# EAGLE schematic PowerCell-vArsalan (EAGLE 7.6.0)
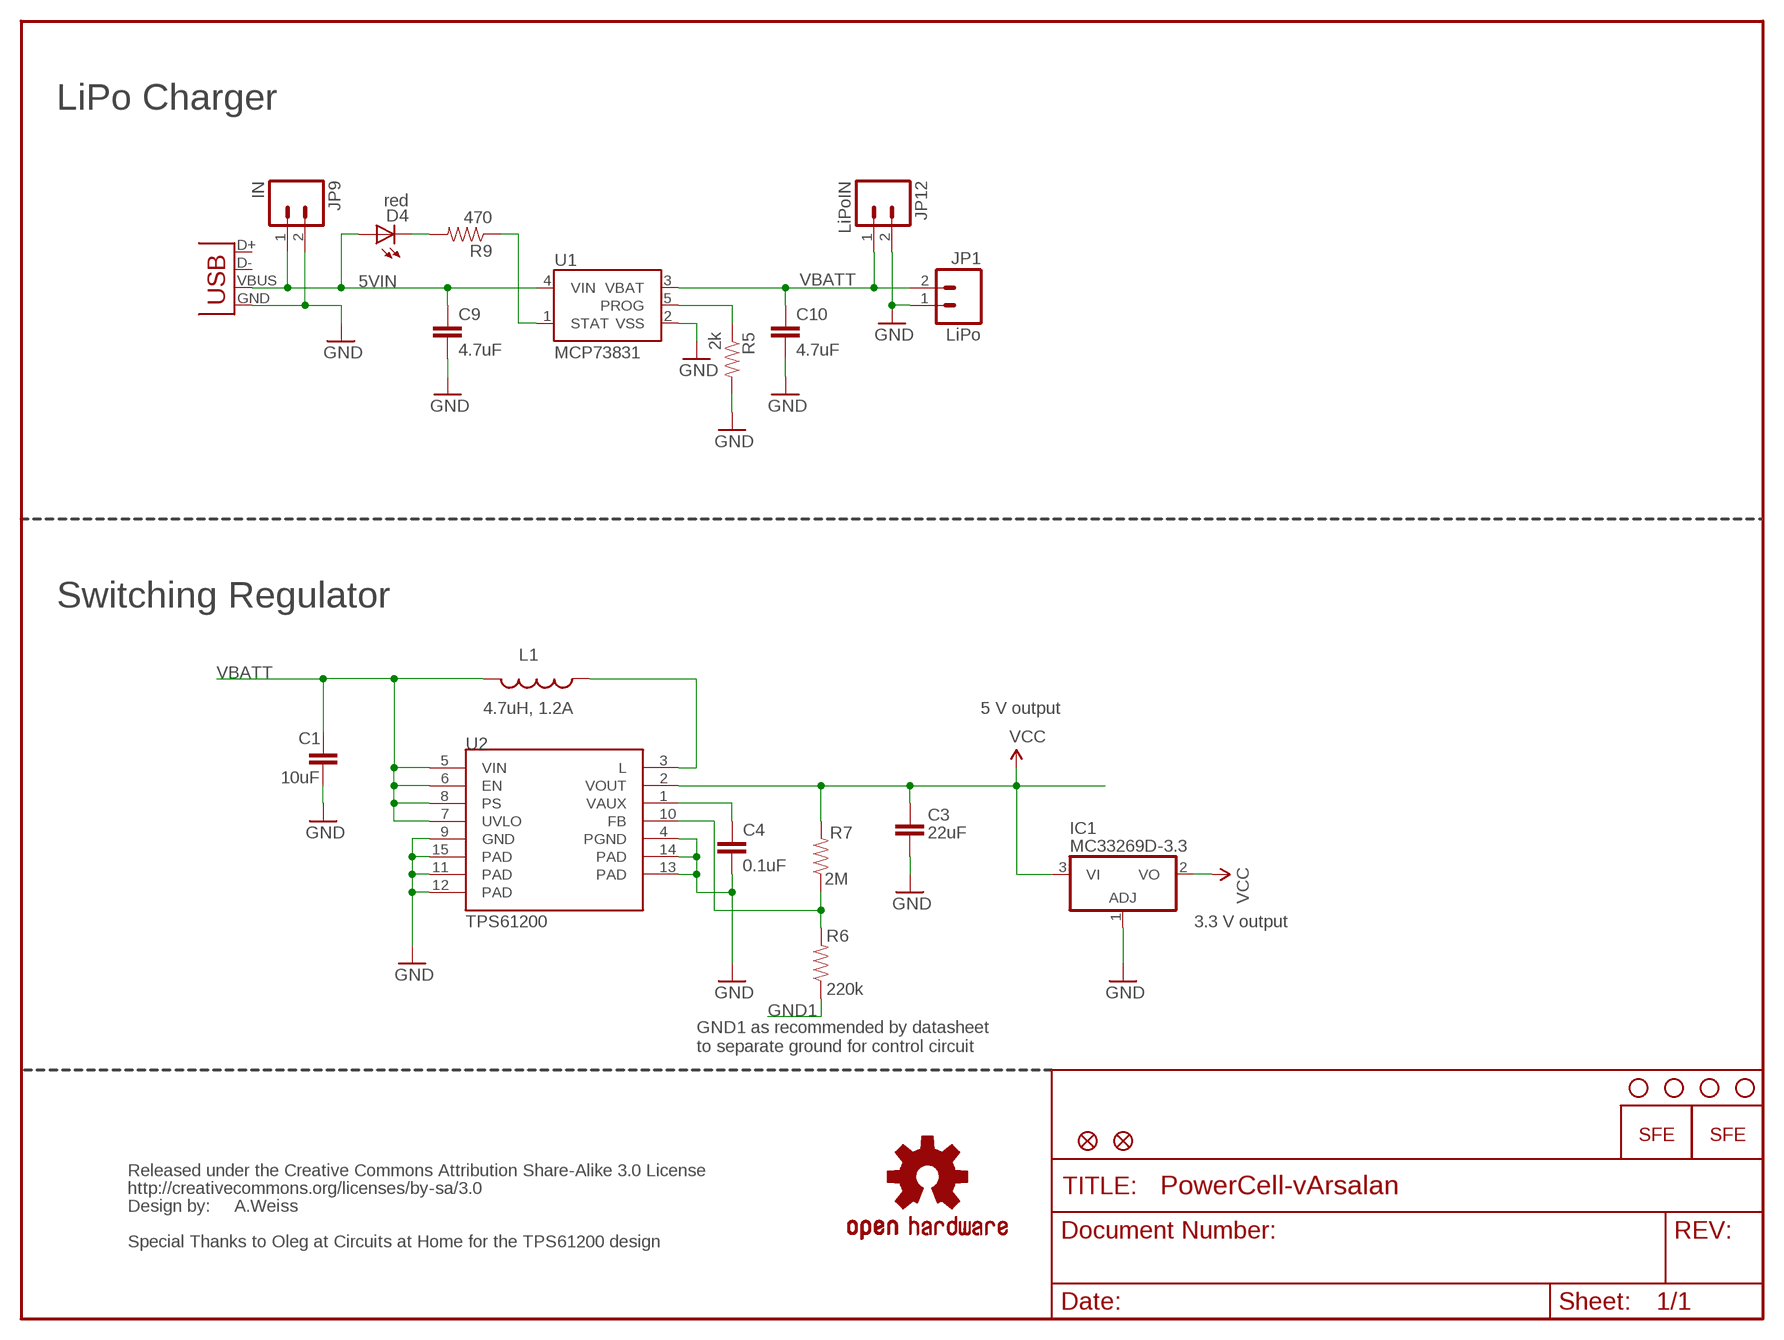
[diagram p0: schematic, sheet 1]

## Parts
C1  10uF  CAP1206  [1206]
C3  22uF  CAP0805  [0805]
C4  0.1uF  CAP0402-CAP  [0402-CAP]
C9  4.7uF  CAP0402-CAP  [0402-CAP]
C10  4.7uF  CAP0402-CAP  [0402-CAP]
D4  red  LED0603  [LED-0603]
IC1  MC33269D-3.3  [DPACK]
JP1  LiPo  M02-JST-2MM-SMT  [JST-2-SMD]
JP3  LOGO-SFENEW  [SFE-NEW-WEBLOGO]
JP4  LOGO-SFESK  [SFE-LOGO-FLAME]
JP5  STAND-OFF  [STAND-OFF]
JP6  STAND-OFF  [STAND-OFF]
JP7  STAND-OFF  [STAND-OFF]
JP8  STAND-OFF  [STAND-OFF]
JP9  IN  M02PTH  [1X02]
JP12  LiPoIN  M02PTH  [1X02]
JP15  FIDUCIALUFIDUCIAL  [MICRO-FIDUCIAL]
JP16  FIDUCIALUFIDUCIAL  [MICRO-FIDUCIAL]
L1  4.7uH, 1.2A  INDUCTOR.  [CDRH2D09]
R5  2k  RESISTOR0402-RES  [0402-RES]
R6  220k  RESISTOR0402-RES  [0402-RES]
R7  2M  RESISTOR0402-RES  [0402-RES]
R9  470  RESISTOR0402-RES  [0402-RES]
U1  MCP73831  [SOT23-5]
U2  TPS61200  [QFN-10_PAD]
U$1  OSHW-LOGOS  [OSHW-LOGO-S]
U$2  CREATIVE_COMMONS  [CREATIVE_COMMONS]
X1  USB-MICROB  [USB-MICROB]

## Nets
5VIN: C9.1 D4.A JP9.1 U1.4(VIN) X1.VBUS
FB: R6.2 R7.1 U2.10(FB)
GND: C1.2 C3.2 C4.2 C9.2 C10.2 IC1.1(ADJ) JP1.1 JP9.2 JP12.2 R5.2 U1.2(VSS) U2.4(PGND) U2.9(GND) U2.11(PAD) U2.12(PAD) U2.13(PAD) U2.14(PAD) U2.15(PAD) X1.GND
GND1: R6.1
N$1: C4.1 U2.1(VAUX)
N$2: L1.P$1 U2.3(L)
N$8: D4.C R9.2
N$11: R5.1 U1.5(PROG)
N$14: R9.1 U1.1(STAT)
VBATT: C1.1 C10.1 JP1.2 JP12.1 L1.P$2 U1.3(VBAT) U2.5(VIN) U2.6(EN) U2.7(UVLO) U2.8(PS)
VCC: C3.1 IC1.2(VO) IC1.3(VI) R7.2 U2.2(VOUT)
Unconnected: X1.D+ X1.D-

## Notes on the sheet
- LiPo Charger
- Switching Regulator
- 5 V output
- 3.3 V output
- GND1 as recommended by datasheet 
  to separate ground for control circuit
- A.Weiss
- Special Thanks to Oleg at Circuits at Home for the TPS61200 design

## Library data of the parts
C1 C3 = CH_passive:CAP: Capacitor Standard 0603 ceramic capacitor, and 0.1" leaded capacitor.
C4 C9 C10 = SparkFun:CAP: Capacitor Standard 0603 ceramic capacitor, and 0.1" leaded capacitor.
D4 = SparkFun:LED: LEDs Standard schematic elements and footprints for 5mm, 3mm, 1206, and 0603 sized LEDs. 5mm - Spark Fun Electronics SKU : COM-00529 (and others)
IC1 = linear:MC33269?*: Adjustable Output Low Dropout Voltage Regulator 800 mA Source: http://www.onsemi.com/pub/Collateral/MC33269-D.PDF
JP1 JP9 JP12 = SparkFun:M02: Header 2 Standard 2-pin 0.1" header. Use with straight break away headers (SKU : PRT-00116), right angle break away headers (PRT-00553), swiss pins (PRT-00743), machine pins (PRT-00117), and female headers (PRT-00115). Molex polarized connector foot print use with SKU : PRT-08233 with associated crimp pins and housings.
JP3 JP4 = SparkFun:LOGO-SFE: Spark Fun Electronics PCB Logo This is the standard Spark Fun Electronics PCB logo.
JP5-JP8 = SparkFun:STAND-OFF: Stand Off This is the mechanical footprint for a #4 phillips button head screw. Use the keepout ring to avoid running the screw head into surrounding components. SKU : PRT-00447
JP15 JP16 = SparkFun:FIDUCIAL: Fiducial Alignment Points Various fiducial points for machine vision alignment.
L1 = SparkFun:INDUCTOR: Inductors Basic Inductor/Choke - 0603 and 1206. Footprints are not proven and vary greatly between part numbers.
R5-R7 R9 = SparkFun:RESISTOR: Resistor Basic schematic elements and footprints for 0603, 1206, and PTH resistors.
U1 = SparkFun:MCP73831: Microchip's MCP73831 Miniature single cell, fully integrated Li-Ion, Li-polymer charge management controller http://ww1.microchip.com/downloads/en/DeviceDoc/21984a.pdf
U2 = SparkFun:TPS61200: DC to DC Booster
U$1 = SparkFun:OSHW-LOGO: Open Source Hardware Logo This logo indicates the piece of hardware it is found on incorporates a OSHW license and/or adheres to the definition of open source hardware found here: http://freedomdefined.org/OSHW
U$2 = SparkFun-Aesthetics:CREATIVE_COMMONS: Creative Commons License summary
X1 = SparkFun:USB: USB Connectors USB-B-PTH is fully proven SKU : PRT-00139 USB-miniB is fully proven SKU : PRT-00587 USB-A-PCB is untested. USB-A-H is throughly reviewed, but untested. Spark Fun Electronics SKU : PRT-00437 USB-B-SMT is throughly reviewed, but untested. Needs silkscreen touching up. USB-A-S has not been used/tested USB-MB-H has not been used/tested